# Altium schematic sheet LCD_Glass_Ext_connector.SchDoc: LCD_Glass_Ext_connector
size A3; Project: STM32L073Z-EVAL; Date: Not used; ApprovedBy: Not used; CheckedBy: Not used; Author: Not used; CompanyName: STMicroelectronics; DrawnBy: Not used; Engineer: Not used; Organization: Not used; Address1: Not used; Address2: Not used; Address3: Not used; Address4: Not used; DocumentNumber: 3; Revision: Not used; SheetNumber: 4; SheetTotal: 13; CurrentTime: Not used; CurrentDate: Not used; Time: Not used; DocumentFullPathAndName: Not used; DocumentName: Not used; ModifiedDate: Not used; ImagePath: Not used; ProjectName: Not used; Application_BuildNumber: Not used
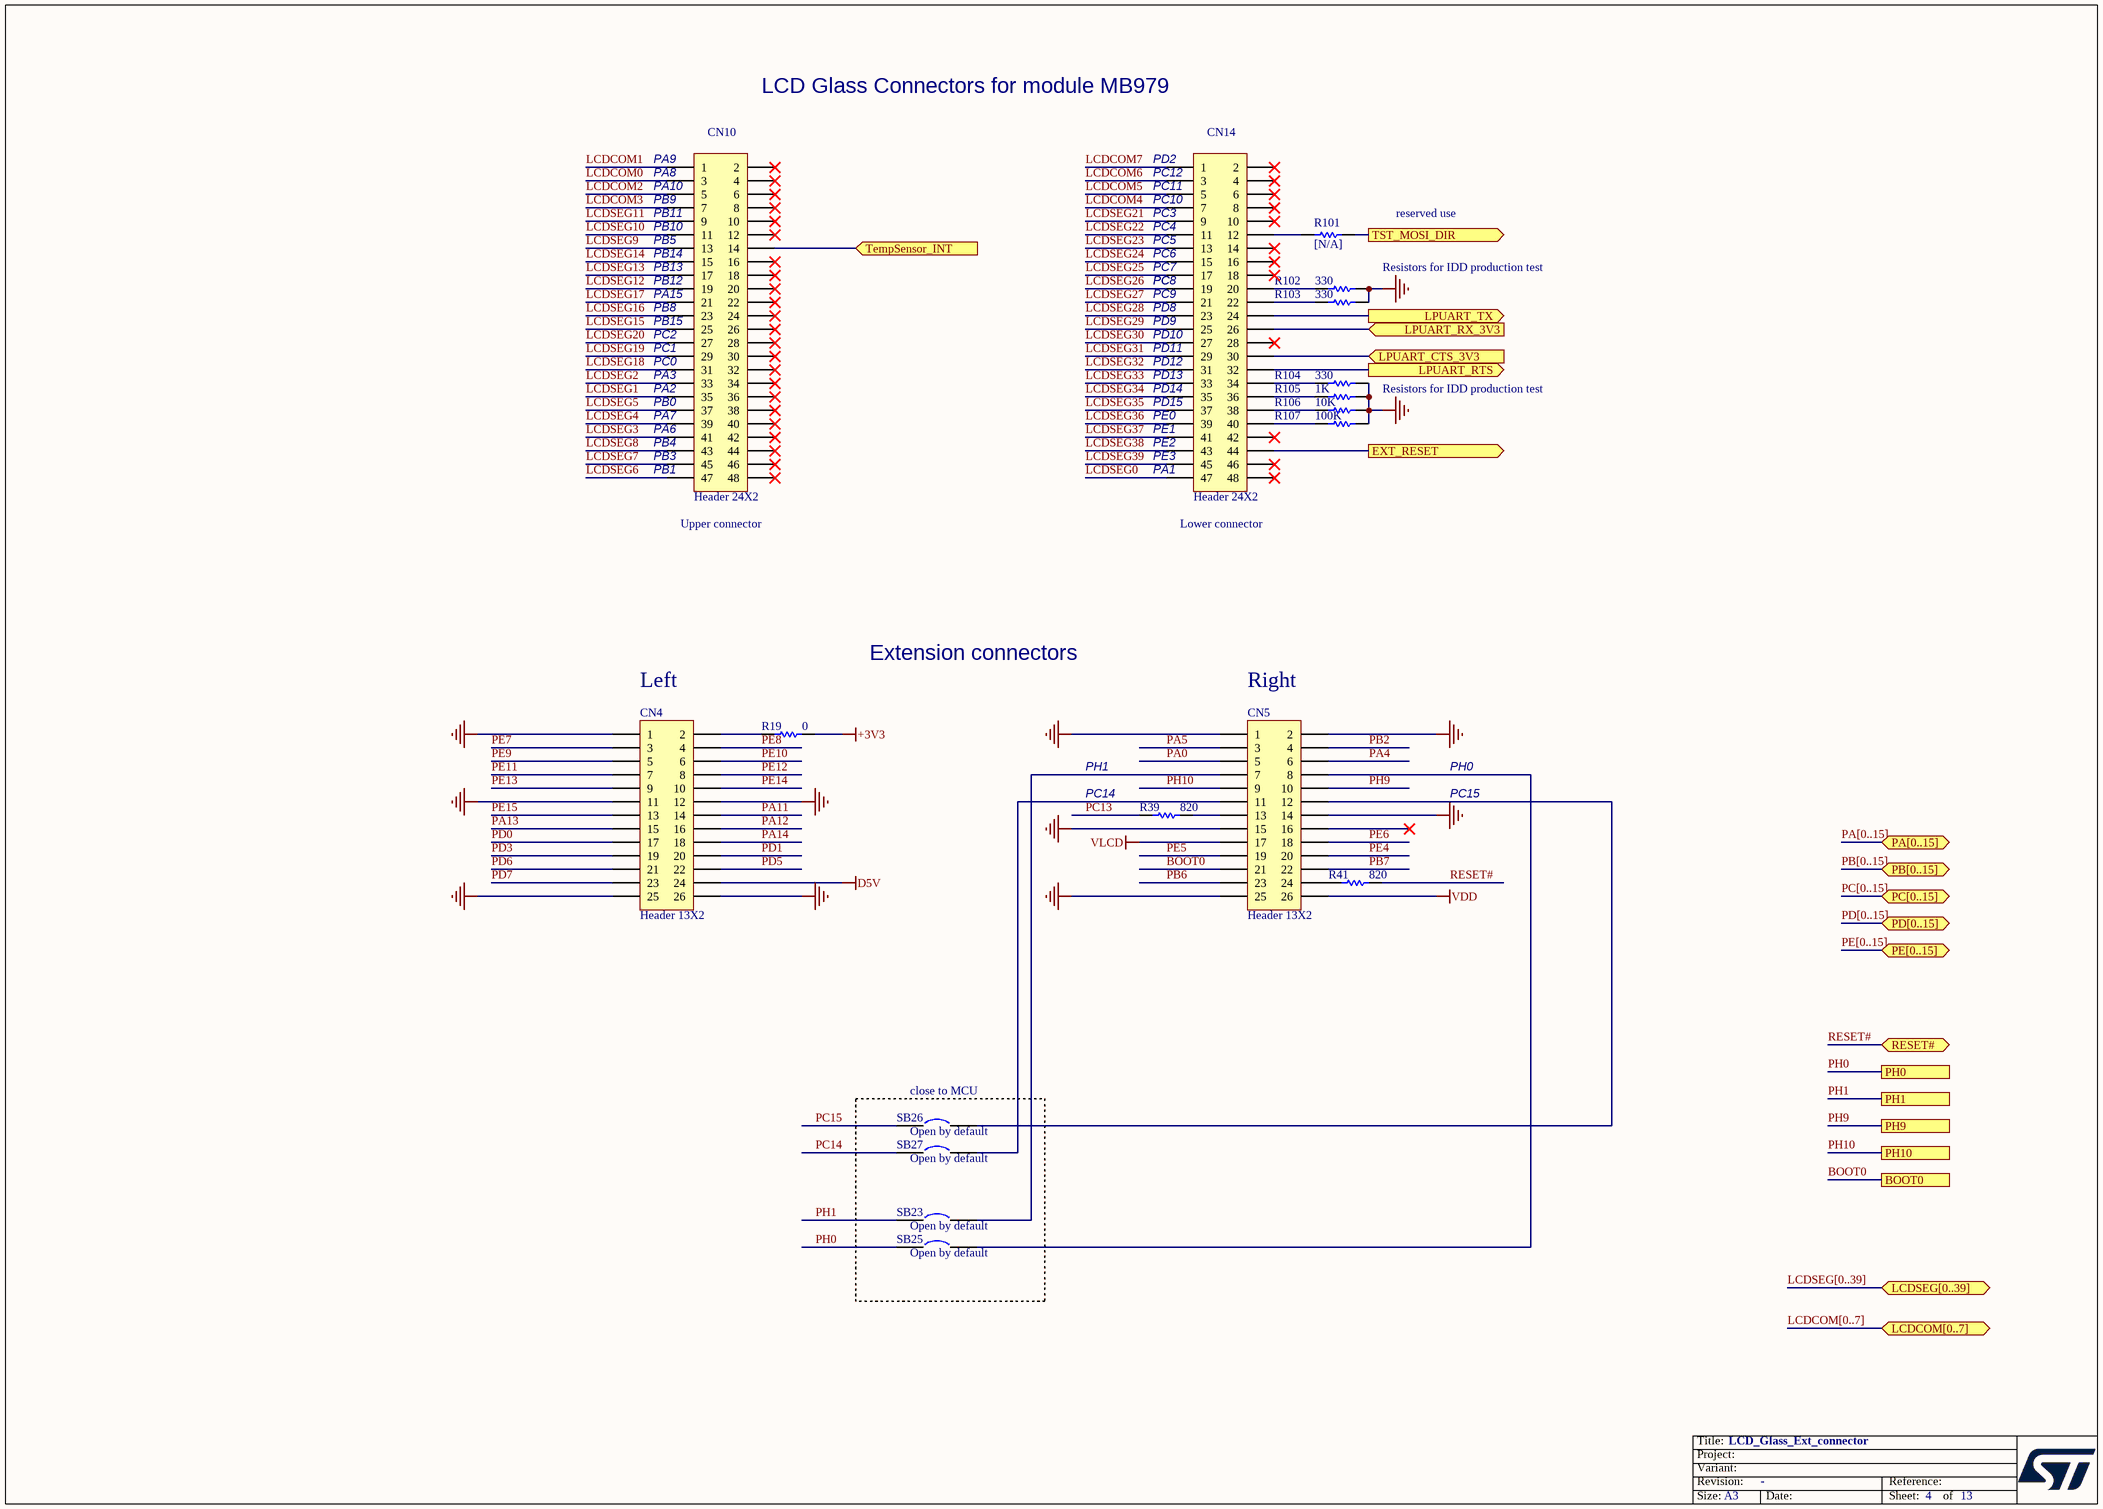
[diagram p0: LCD_Glass_Ext_connector.SchDoc]

## Parts
CN4  Header 13X2  [HDR_2X13_2R54]
CN5  Header 13X2  [HDR_2X13_2R54]
CN10  Header 24X2  [HDR_2X24_2R54]
CN14  Header 24X2  [HDR_2X24_2R54]
R19  0  [0603R]
R39  820  [0603R]
R41  820  [0603R]
R101  [N/A]  [0603R]
R102  330  [0603R]
R103  330  [0603R]
R104  330  [0603R]
R105  1K  [0402R]
R106  10K  [0603R]
R107  100K  [0603R]
SB23  Open by default  [SB_0603]
SB25  Open by default  [SB_0603]
SB26  Open by default  [SB_0603]
SB27  Open by default  [SB_0603]

## Blocks framed on the sheet
close to MCU: SB23 SB25-SB27

## Ports
BOOT0, EXT_RESET (out), LCDCOM[0..7] (bidir), LCDSEG[0..39] (bidir), LPUART_CTS_3V3 (in), LPUART_RTS (out), LPUART_RX_3V3 (in), LPUART_TX (out), PA[0..15] (bidir), PB[0..15] (bidir), PC[0..15] (bidir), PD[0..15] (bidir), PE[0..15] (bidir), PH0, PH1, PH9, PH10, RESET# (bidir), TempSensor_INT (in), TST_MOSI_DIR (out)

## Nets
+3V3: R19.1
D5V: CN4.24
GND: CN4.1 CN4.11 CN4.12 CN4.25 CN4.26 CN5.1 CN5.2 CN5.14 CN5.15 CN5.25 R102.1 R103.1 R104.1 R105.2 R106.1 R107.1
VDD: CN5.26
VLCD: CN5.17
BOOT0: CN5.21 ; port BOOT0
EXT_RESET: CN14.44 ; port EXT_RESET
LCDCOM0: CN10.3
LCDCOM1: CN10.1
LCDCOM2: CN10.5
LCDCOM3: CN10.7
LCDCOM4: CN14.7
LCDCOM5: CN14.5
LCDCOM6: CN14.3
LCDCOM7: CN14.1
LCDSEG0: CN14.47
LCDSEG1: CN10.35
LCDSEG2: CN10.33
LCDSEG3: CN10.41
LCDSEG4: CN10.39
LCDSEG5: CN10.37
LCDSEG6: CN10.47
LCDSEG7: CN10.45
LCDSEG8: CN10.43
LCDSEG9: CN10.13
LCDSEG10: CN10.11
LCDSEG11: CN10.9
LCDSEG12: CN10.19
LCDSEG13: CN10.17
LCDSEG14: CN10.15
LCDSEG15: CN10.25
LCDSEG16: CN10.23
LCDSEG17: CN10.21
LCDSEG18: CN10.31
LCDSEG19: CN10.29
LCDSEG20: CN10.27
LCDSEG21: CN14.9
LCDSEG22: CN14.11
LCDSEG23: CN14.13
LCDSEG24: CN14.15
LCDSEG25: CN14.17
LCDSEG26: CN14.19
LCDSEG27: CN14.21
LCDSEG28: CN14.23
LCDSEG29: CN14.25
LCDSEG30: CN14.27
LCDSEG31: CN14.29
LCDSEG32: CN14.31
LCDSEG33: CN14.33
LCDSEG34: CN14.35
LCDSEG35: CN14.37
LCDSEG36: CN14.39
LCDSEG37: CN14.41
LCDSEG38: CN14.43
LCDSEG39: CN14.45
LPUART_CTS_3V3: CN14.30 ; port LPUART_CTS_3V3
LPUART_RTS: CN14.32 ; port LPUART_RTS
LPUART_RX_3V3: CN14.26 ; port LPUART_RX_3V3
LPUART_TX: CN14.24 ; port LPUART_TX
PA0: CN5.5
PA4: CN5.6
PA5: CN5.3
PA11: CN4.14
PA12: CN4.16
PA13: CN4.15
PA14: CN4.18
PB2: CN5.4
PB6: CN5.23
PB7: CN5.22
PC13: R39.1
PC14: SB27.1
PC15: SB26.1
PD0: CN4.17
PD1: CN4.20
PD3: CN4.19
PD5: CN4.22
PD6: CN4.21
PD7: CN4.23
PE4: CN5.20
PE5: CN5.19
PE6: CN5.18
PE7: CN4.3
PE8: CN4.4
PE9: CN4.5
PE10: CN4.6
PE11: CN4.7
PE12: CN4.8
PE13: CN4.9
PE14: CN4.10
PE15: CN4.13
PH0: SB25.1 ; port PH0
PH1: SB23.1 ; port PH1
PH9: CN5.10 ; port PH9
PH10: CN5.9 ; port PH10
RESET#: R41.1 ; port RESET#
TempSensor_INT: CN10.14 ; port TempSensor_INT
TST_MOSI_DIR: R101.1 ; port TST_MOSI_DIR
NetCN4_2: CN4.2 R19.2
NetCN5_7: CN5.7 SB23.2
NetCN5_8: CN5.8 SB25.2
NetCN5_11: CN5.11 SB27.2
NetCN5_12: CN5.12 SB26.2
NetCN5_13: CN5.13 R39.2
NetCN5_24: CN5.24 R41.2
NetCN14_12: CN14.12 R101.2
NetCN14_20: CN14.20 R102.2
NetCN14_22: CN14.22 R103.2
NetCN14_34: CN14.34 R104.2
NetCN14_36: CN14.36 R105.1
NetCN14_38: CN14.38 R106.2
NetCN14_40: CN14.40 R107.2

Not connected (* = marked no-connect by the designer): CN5 16*; CN10 2* 4* 6* 8* 10* 12* 16* 18* 20* 22* 24* 26* 28* 30* 32* 34* 36* 38* 40* 42* 44* 46* 48*; CN14 2* 4* 6* 8* 10* 14* 16* 18* 28* 42* 46* 48*

## Buses and harness runs
bus LCDCOM[0..7] = port LCDCOM[0..7]
bus LCDSEG[0..39] = port LCDSEG[0..39]
bus PA[0..15] = port PA[0..15]
bus PB[0..15] = port PB[0..15]
bus PC[0..15] = port PC[0..15]
bus PD[0..15] = port PD[0..15]
bus PE[0..15] = port PE[0..15]

## Notes on the sheet
- LCD Glass Connectors for module MB979
- (near CN10) PA9
- (near CN10) PA8
- (near CN14) PD2
- (near CN14) PC12
- (near CN10) PA10
- (near CN10) PB9
- (near CN10) PB11
- (near CN10) PB10
- (near CN10) PB5
- (near CN14) PC11
- (near CN14) PC10
- (near CN14) PC4
- (near CN14) PC5
- (near CN14) PC3
- reserved use
- (near CN10) PA15
- (near CN10) PB14
- (near CN10) PB13
- (near CN10) PB12
- (near CN10) PB8
- (near CN14) PD8
- (near CN14) PC6
- (near CN14) PC7
- (near CN14) PC
- (near CN14) PC8
- (near CN14) PC9
- Resistors for IDD production test
- (near CN10) PA3
- (near CN10) PB15
- (near CN10) PC2
- (near CN10) PC1
- (near CN10) PC0
- (near CN14) PD11
- (near CN14) PD12
- (near CN14) PD13
- (near CN14) PD10
- (near CN14) PD9
- (near CN10) PA2
- (near CN10) PA7
- (near CN10) PA6
- (near CN10) PB0
- (near CN10) PB4
- (near CN14) PD14
- (near CN14) PD15
- (near CN14) PE0
- (near CN14) PE1
- (near CN14) PE2
- (near CN10) PB3
- (near CN10) PB1
- (near CN14) PE3
- (near CN14) PA1
- (near CN10) Upper connector
- (near CN14) Lower connector
- (near CN4) Left
- Extension connectors
- (near CN5) Right
- PH1
- PH0
- (near R39) PC14
- PC15
- Title:
- Project:
- Size:
- Revision:
- Variant:
- A3
- -
- Date:
- Reference:
- Sheet:
- of

## Library data of the parts
CN4 CN5 = Header 13X2: Header, 13-Pin, Dual row; Manuf_1: lwconn; Manuf_Part_1: 313280S112116; Ordered by: Subcon; LatestRevisionDate: 17-Jul-2002; LatestRevisionNote: Re-released for DXP Platform.; Publisher: Altium Limited; ECCN_US/EU: n/a
CN10 CN14 = Header 24X2: Header, 24-Pin, Dual row; Manuf_1: lwconn; Manuf_Part_1: 213248S1311; Ordered by: Subcon; Comments: LCD Glass connector; Assembly: with MB979; Revision: 17-Jul-2002: Re-released for DXP Platform.; Publisher: Altium Limited; ECCN_US/EU: n/a
R19 R39 R41 = Res1: Resistor; Value: 1K; Ordered by: Subcon; Published: 8-Jun-2000; Revision: July-2002: Re-released for DXP Platform.; Publisher: Altium Limited; ECCN_US/EU: n/a
R101 = res1: Resistor; Value: 1K; Ordered by: Subcon; Fitted: NO; Published: 8-Jun-2000; Revision: July-2002: Re-released for DXP Platform.; Publisher: Altium Limited; ECCN_US/EU: n/a
R102-R104 R106 R107 = res1: Resistor; Value: 1K; Ordered by: Subcon; Published: 8-Jun-2000; Revision: July-2002: Re-released for DXP Platform.; Publisher: Altium Limited; ECCN_US/EU: n/a
R105 = Res1: Resistor; Ordered by: Subcon; Published: 8-Jun-2000; Revision: July-2002: Re-released for DXP Platform.; Publisher: Altium Limited; Value: 1K; ECCN_US/EU: n/a
SB23 SB25-SB27 = Circuit Breaker: Ordered by: Subcon; Comments: Solder bridge; Fitted: NO; Published: 24-Mar-1999; Revision: July-2002: Re-released for DXP Platform.; Publisher: Altium Limited; ECCN_US/EU: n/a